# EAGLE schematic geiger (EAGLE 9.4.2)
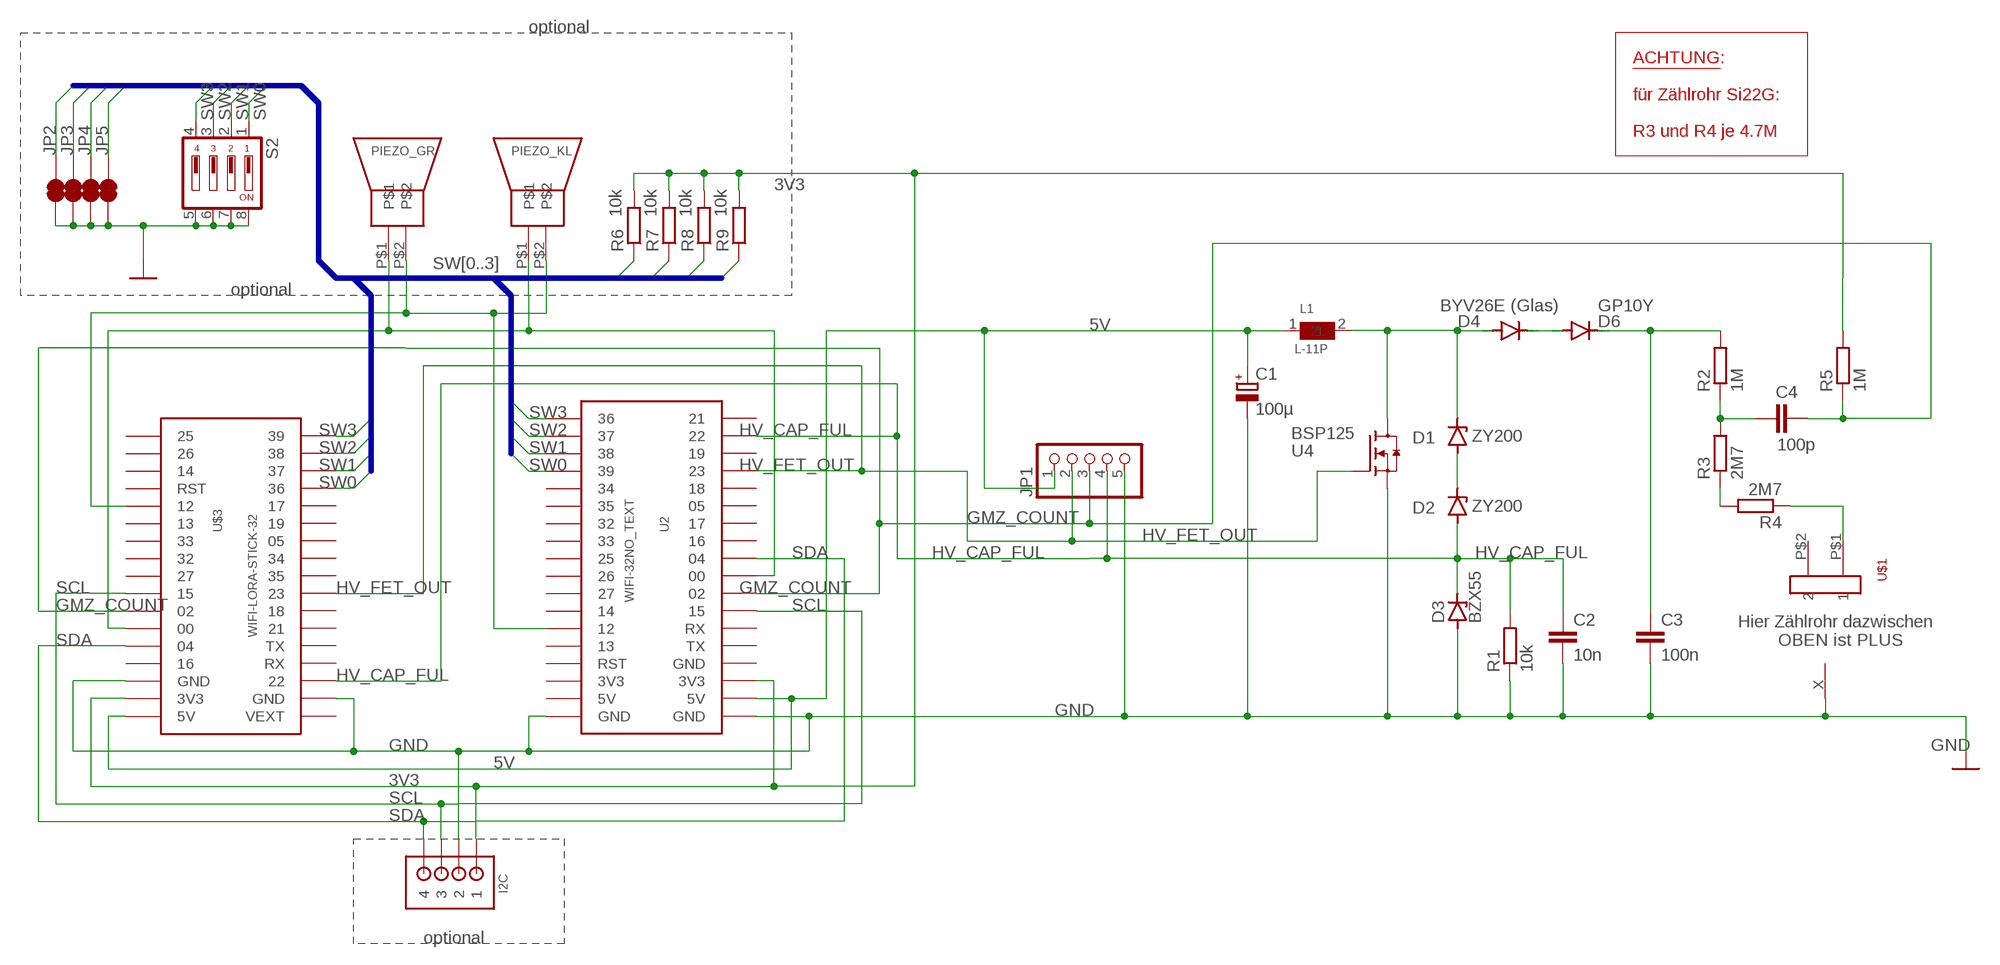
[diagram p0: schematic, sheet 1]

## Parts
C1  100µ  CPOL-EUE2-5  [E2-5]
C2  10n  C-EU050-035X075  [C050-035X075]
C3  100n  C-EU150-072X183  [C150-072X183]
C4  100p  C-EU050-045X075  [C050-045X075]
D1  ZY200  ZENER-DIODEDO41Z10  [DO41Z10]
D2  ZY200  ZENER-DIODEDO41Z10  [DO41Z10]
D3  BZX55  [DO35Z10]
D4  BYV26E (Glas)  1N4004  [DO41-10]
D6  GP10Y  1N4004  [DO41-10]
I2C  B4B-ZRSIDE_ENTRY  [S4B-ZR]
JP1  PINHD-1X5  [1X05]
JP2  Jumper  JUMPER-SMT_2_NC_TRACE_NO-SILK  [SMT-JUMPER_2_NC_TRACE_NO-SILK]
JP3  JUMPER-SMT_2_NC_TRACE_NO-SILK  [SMT-JUMPER_2_NC_TRACE_NO-SILK]
JP4  JUMPER-SMT_2_NC_TRACE_NO-SILK  [SMT-JUMPER_2_NC_TRACE_NO-SILK]
JP5  JUMPER-SMT_2_NC_TRACE_NO-SILK  [SMT-JUMPER_2_NC_TRACE_NO-SILK]
L1  L-11P  [L-11P]
PIEZO_GR  PIEPSER_BIG  [PIEPSER_BIG]
PIEZO_KL  PIEPSER  [PIEPSER]
R1  10k  R-EU_0207/10  [0207/10]
R2  1M  R-EU_0207/10  [0207/10]
R3  2M7  R-EU_0207/10  [0207/10]
R4  2M7  R-EU_0207/10  [0207/10]
R5  1M  R-EU_0207/10  [0207/10]
R6  10k  R-EU_M0805  [M0805]
R7  10k  R-EU_M0805  [M0805]
R8  10k  R-EU_M0805  [M0805]
R9  10k  R-EU_M0805  [M0805]
S2  DIP04YL  [DIP04YL]
U2  WIFI-32NO_TEXT  [2.54MM_2X18_NOLORA_NOTEXT]
U4  BSP125  [SOT223]
U$1  FUSE_HOLDER  [FUSE_HOLDER]
U$3  WIFI-LORA-STICK-32  [2.54MM_2X18_STICK_NO_TEXT]
U$5  ONE_PAD  [ONE_PAD]

## Nets
3V3: I2C.1 R5.2 R6.2 R7.2 R8.2 R9.2 U2.P$34(3V3) U$3.P$33(3V3)
5V: C1.+ JP1.1 L1.1 U2.P$35(5V) U$3.P$34(5V)
GMZ_COUNT: C4.2 JP1.3 R5.1 U2.P$29 U$3.P$28
GND: C1.- C2.2 C3.2 D3.A I2C.2 JP1.5 JP2.1 JP3.1 JP4.1 JP5.1 R1.1 S2.5 S2.6 S2.7 S2.8 U2.P$1(GND) U2.P$36(GND) U4.3(S) U$3.P$2(GND) U$3.P$32(GND) U$5.X
HV_CAP_FUL: C2.1 D2.A D3.C JP1.4 R1.2 U2.P$20 U$3.P$3
HV_FET_OUT: JP1.2 U2.P$22 U4.1(G) U$3.P$8
N$2: D1.A D2.C
N$3: D1.C D4.A L1.2 U4.2(D) U4.4(D)
N$4: C3.1 D6.C R2.2
N$5: R4.1 U$1.P$1
N$6: R3.1 R4.2
N$7: C4.1 R2.1 R3.2
N$9: D4.C D6.A
N$13: PIEZO_GR.P$2 PIEZO_KL.P$2 U2.P$6 U$3.P$22
N$14: PIEZO_GR.P$1 PIEZO_KL.P$1 U2.P$28 U$3.P$29
SCL: I2C.3 U2.P$30 U$3.P$27
SDA: I2C.4 U2.P$27 U$3.P$30
SW0: JP5.2 R6.1 S2.1 U2.P$15 U$3.P$14
SW1: JP4.2 R7.1 S2.2 U2.P$16 U$3.P$15
SW2: JP3.2 R8.1 S2.3 U2.P$17 U$3.P$16
SW3: JP2.2 R9.1 S2.4 U2.P$18 U$3.P$17
Unconnected: U2.P$2(5V) U2.P$3(3V3) U2.P$4(RST) U2.P$5 U2.P$7 U2.P$8 U2.P$9 U2.P$10 U2.P$11 U2.P$12 U2.P$13 U2.P$14 U2.P$19 U2.P$21 U2.P$23 U2.P$24 U2.P$25 U2.P$26 U2.P$31(RX) U2.P$32(TX) U2.P$33(GND) U$1.P$2 U$3.P$1(VEXT) U$3.P$4(RX) U$3.P$5(TX) U$3.P$6 U$3.P$7 U$3.P$9 U$3.P$10 U$3.P$11 U$3.P$12 U$3.P$13 U$3.P$18 U$3.P$19 U$3.P$20 U$3.P$21(RST) U$3.P$23 U$3.P$24 U$3.P$25 U$3.P$26 U$3.P$31

## Buses
SW[0..3]

## Notes on the sheet
- optional
- ACHTUNG:
  
  für Zählrohr Si22G:
  
  R3 und R4 je 4.7M
- optional
- Hier Zählrohr dazwischen
          OBEN ist PLUS
- optional

## Library data of the parts
C1 = rcl:CPOL-EU: POLARIZED CAPACITOR, European symbol; SPICEPREFIX: C
C2-C4 = rcl:C-EU: CAPACITOR, European symbol; SPICEPREFIX: C
D1 D2 = diode:ZENER-DIODE: Z-Diode
D3 = tlc5940:BZX55: Z DIODE
D4 D6 = diode:1N4004: DIODE general purpose rectifier, 1 A
I2C = jst:B4B-ZR: JST-ZH Connector 4 pol, 1.5mm pitch Package: B4B-ZR Source: http://www.jst-mfg.com/product/pdf/eng/eZH.pdf
JP1 = pinhead:PINHD-1X5: PIN HEADER
JP2-JP5 = SparkFun-Jumpers:JUMPER-SMT_2_NC_TRACE: Normally closed trace jumper This jumper has a trace between two pads so it's normally closed (NC). Use a razor knife to open the connection. For best results follow the IPC guidelines for cutting traces: Cutout at least 0.063 mm (0.005 in). Remove all loose material to clean up the cut area. Seal the cut with an approved epoxy. Reapply solder to reclose the connection.
L1 = tlc5940:L-11P
PIEZO_GR = tlc5940:PIEPSER_BIG
PIEZO_KL = tlc5940:PIEPSER
R1-R9 = rcl:R-EU_: RESISTOR, European symbol; SPICEPREFIX: R
S2 = switch-dil:DIP04YL: DIL/CODE SWITCH; OC_FARNELL: unknown; OC_NEWARK: unknown
U2 = ESP32_modules:WIFI-32
U4 = tlc5940:BSP125
U$1 = tlc5940:FUSE_HOLDER
U$3 = ESP32_modules:WIFI-LORA-STICK-32
U$5 = tlc5940:ONE_PAD

## Net classes
0 default: clearance 0.205 mm